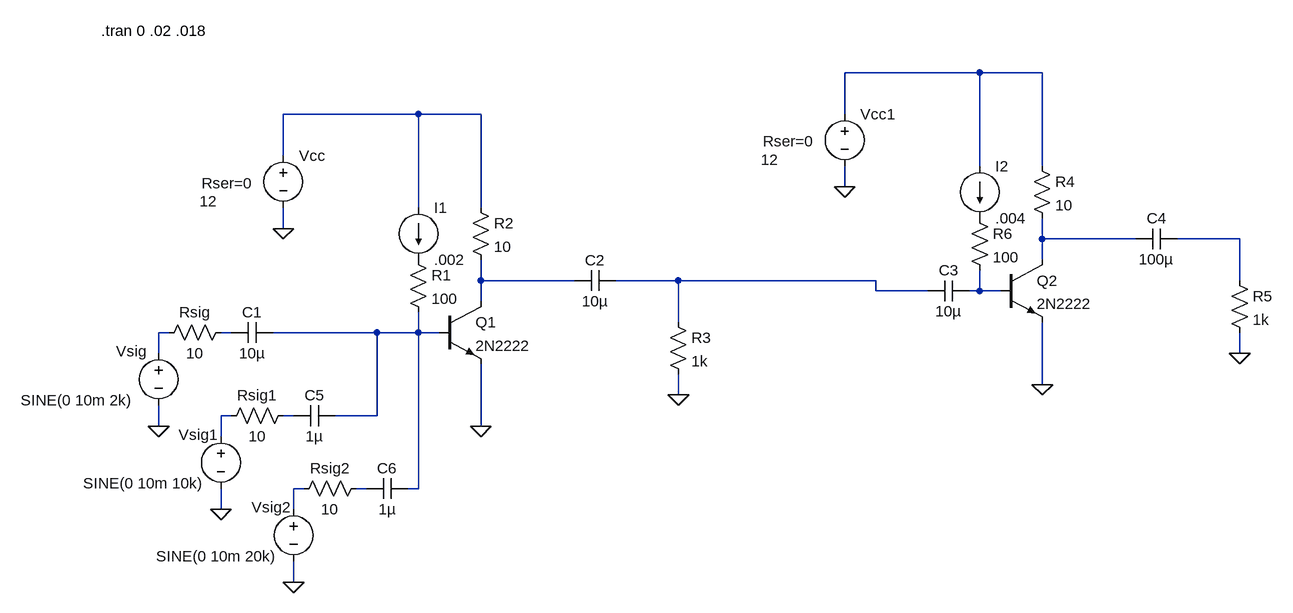
[diagram p0: schematic Emissor_Comum.asc]
Emissor_Comum.asc, the LTspice schematic file:
Version 4
SHEET 1 1524 948
WIRE 896 -288 688 -288
WIRE 992 -288 896 -288
WIRE 32 -224 -176 -224
WIRE 128 -224 32 -224
WIRE 688 -224 688 -288
WIRE -176 -160 -176 -224
WIRE 896 -144 896 -288
WIRE 992 -144 992 -288
WIRE 688 -112 688 -144
WIRE 32 -80 32 -224
WIRE 128 -80 128 -224
WIRE -176 -48 -176 -80
WIRE 992 -32 992 -64
WIRE 1136 -32 992 -32
WIRE 1296 -32 1200 -32
WIRE 992 0 992 -32
WIRE 128 32 128 0
WIRE 272 32 128 32
WIRE 432 32 336 32
WIRE 736 32 432 32
WIRE 1296 32 1296 -32
WIRE 736 48 736 32
WIRE 816 48 736 48
WIRE 896 48 896 16
WIRE 896 48 880 48
WIRE 928 48 896 48
WIRE 128 64 128 32
WIRE 432 96 432 32
WIRE -352 112 -368 112
WIRE -256 112 -272 112
WIRE -32 112 -192 112
WIRE 32 112 32 80
WIRE 32 112 -32 112
WIRE 64 112 32 112
WIRE -368 144 -368 112
WIRE 1296 144 1296 112
WIRE 992 192 992 96
WIRE 432 208 432 176
WIRE -256 240 -272 240
WIRE -160 240 -176 240
WIRE -32 240 -32 112
WIRE -32 240 -96 240
WIRE -368 256 -368 224
WIRE 128 256 128 160
WIRE -272 272 -272 240
WIRE -144 352 -160 352
WIRE -48 352 -64 352
WIRE 32 352 32 112
WIRE 32 352 16 352
WIRE -272 384 -272 352
WIRE -160 384 -160 352
WIRE -160 496 -160 464
FLAG 432 208 0
FLAG -368 256 0
FLAG -176 -48 0
FLAG 128 256 0
FLAG 1296 144 0
FLAG 688 -112 0
FLAG 992 192 0
FLAG -272 384 0
FLAG -160 496 0
SYMBOL voltage -368 128 R0
WINDOW 0 -65 13 Left 2
WINDOW 3 -212 88 Left 2
WINDOW 123 -212 113 Left 2
WINDOW 39 -215 136 Left 2
SYMATTR InstName Vsig
SYMATTR Value SINE(0 10m 2k)
SYMBOL npn 64 64 R0
SYMATTR InstName Q1
SYMATTR Value 2N2222
SYMBOL res -256 96 R90
WINDOW 0 0 56 VBottom 2
WINDOW 3 32 56 VTop 2
SYMATTR InstName Rsig
SYMATTR Value 10
SYMBOL cap -192 96 R90
WINDOW 0 0 32 VBottom 2
WINDOW 3 32 32 VTop 2
SYMATTR InstName C1
SYMATTR Value 10µ
SYMBOL res 112 -96 R0
SYMATTR InstName R2
SYMATTR Value 10
SYMBOL res 416 80 R0
SYMATTR InstName R3
SYMATTR Value 1k
SYMBOL cap 336 16 R90
WINDOW 0 0 32 VBottom 2
WINDOW 3 32 32 VTop 2
SYMATTR InstName C2
SYMATTR Value 10µ
SYMBOL voltage -176 -176 R0
WINDOW 3 -129 86 Left 2
WINDOW 123 0 0 Left 2
WINDOW 39 -126 58 Left 2
SYMATTR InstName Vcc
SYMATTR Value 12
SYMATTR SpiceLine Rser=0
SYMBOL res 16 -16 R0
SYMATTR InstName R1
SYMATTR Value 100
SYMBOL current 32 -80 R0
WINDOW 123 0 0 Left 2
WINDOW 39 0 0 Left 2
SYMATTR InstName I1
SYMATTR Value .002
SYMBOL npn 928 0 R0
SYMATTR InstName Q2
SYMATTR Value 2N2222
SYMBOL cap 880 32 R90
WINDOW 0 0 32 VBottom 2
WINDOW 3 32 32 VTop 2
SYMATTR InstName C3
SYMATTR Value 10µ
SYMBOL res 976 -160 R0
SYMATTR InstName R4
SYMATTR Value 10
SYMBOL res 1280 16 R0
SYMATTR InstName R5
SYMATTR Value 1k
SYMBOL cap 1200 -48 R90
WINDOW 0 0 32 VBottom 2
WINDOW 3 32 32 VTop 2
SYMATTR InstName C4
SYMATTR Value 100µ
SYMBOL voltage 688 -240 R0
WINDOW 3 -129 86 Left 2
WINDOW 123 0 0 Left 2
WINDOW 39 -126 58 Left 2
SYMATTR InstName Vcc1
SYMATTR Value 12
SYMATTR SpiceLine Rser=0
SYMBOL res 880 -80 R0
SYMATTR InstName R6
SYMATTR Value 100
SYMBOL current 896 -144 R0
WINDOW 123 0 0 Left 2
WINDOW 39 0 0 Left 2
SYMATTR InstName I2
SYMATTR Value .004
SYMBOL voltage -272 256 R0
WINDOW 0 -65 13 Left 2
WINDOW 3 -212 88 Left 2
WINDOW 123 -212 113 Left 2
WINDOW 39 -215 136 Left 2
SYMATTR InstName Vsig1
SYMATTR Value SINE(0 10m 10k)
SYMBOL res -160 224 R90
WINDOW 0 0 56 VBottom 2
WINDOW 3 32 56 VTop 2
SYMATTR InstName Rsig1
SYMATTR Value 10
SYMBOL cap -96 224 R90
WINDOW 0 0 32 VBottom 2
WINDOW 3 32 32 VTop 2
SYMATTR InstName C5
SYMATTR Value 1µ
SYMBOL voltage -160 368 R0
WINDOW 0 -65 13 Left 2
WINDOW 3 -212 88 Left 2
WINDOW 123 -212 113 Left 2
WINDOW 39 -215 136 Left 2
SYMATTR InstName Vsig2
SYMATTR Value SINE(0 10m 20k)
SYMBOL res -48 336 R90
WINDOW 0 0 56 VBottom 2
WINDOW 3 32 56 VTop 2
SYMATTR InstName Rsig2
SYMATTR Value 10
SYMBOL cap 16 336 R90
WINDOW 0 0 32 VBottom 2
WINDOW 3 32 32 VTop 2
SYMATTR InstName C6
SYMATTR Value 1µ
TEXT -456 -352 Left 2 !.tran 0 .02 .018

The netlist it stands for:
* Emissor_Comum.asc
Vsig N008 0 SINE(0 10m 2k)
Q1 N005 N010 0 0 2N2222
Rsig N009 N008 10
C1 N010 N009 10µ
R2 N002 N005 10
R3 N006 0 1k
C2 N006 N005 10µ
Vcc N002 0 12 Rser=0
R1 P001 N010 100
I1 N002 P001 .002
Q2 N003 N007 0 0 2N2222
C3 N007 N006 10µ
R4 N001 N003 10
R5 N004 0 1k
C4 N004 N003 100µ
Vcc1 N001 0 12 Rser=0
R6 P002 N007 100
I2 N001 P002 .004
Vsig1 N011 0 SINE(0 10m 10k)
Rsig1 N012 N011 10
C5 N010 N012 1µ
Vsig2 N013 0 SINE(0 10m 20k)
Rsig2 N014 N013 10
C6 N010 N014 1µ
.model NPN NPN
.model PNP PNP
.lib standard.bjt
.tran 0 .02 .018
.backanno
.end